# Altium schematic sheet Ideal Diode.SchDoc
size A4; Organization: TESLA Motors, INC; Address1: 3500 Deer Creek Road; Address2: Palo Alto, CA; Address4: U.S.A.; SheetNumber: 3; SheetTotal: 13
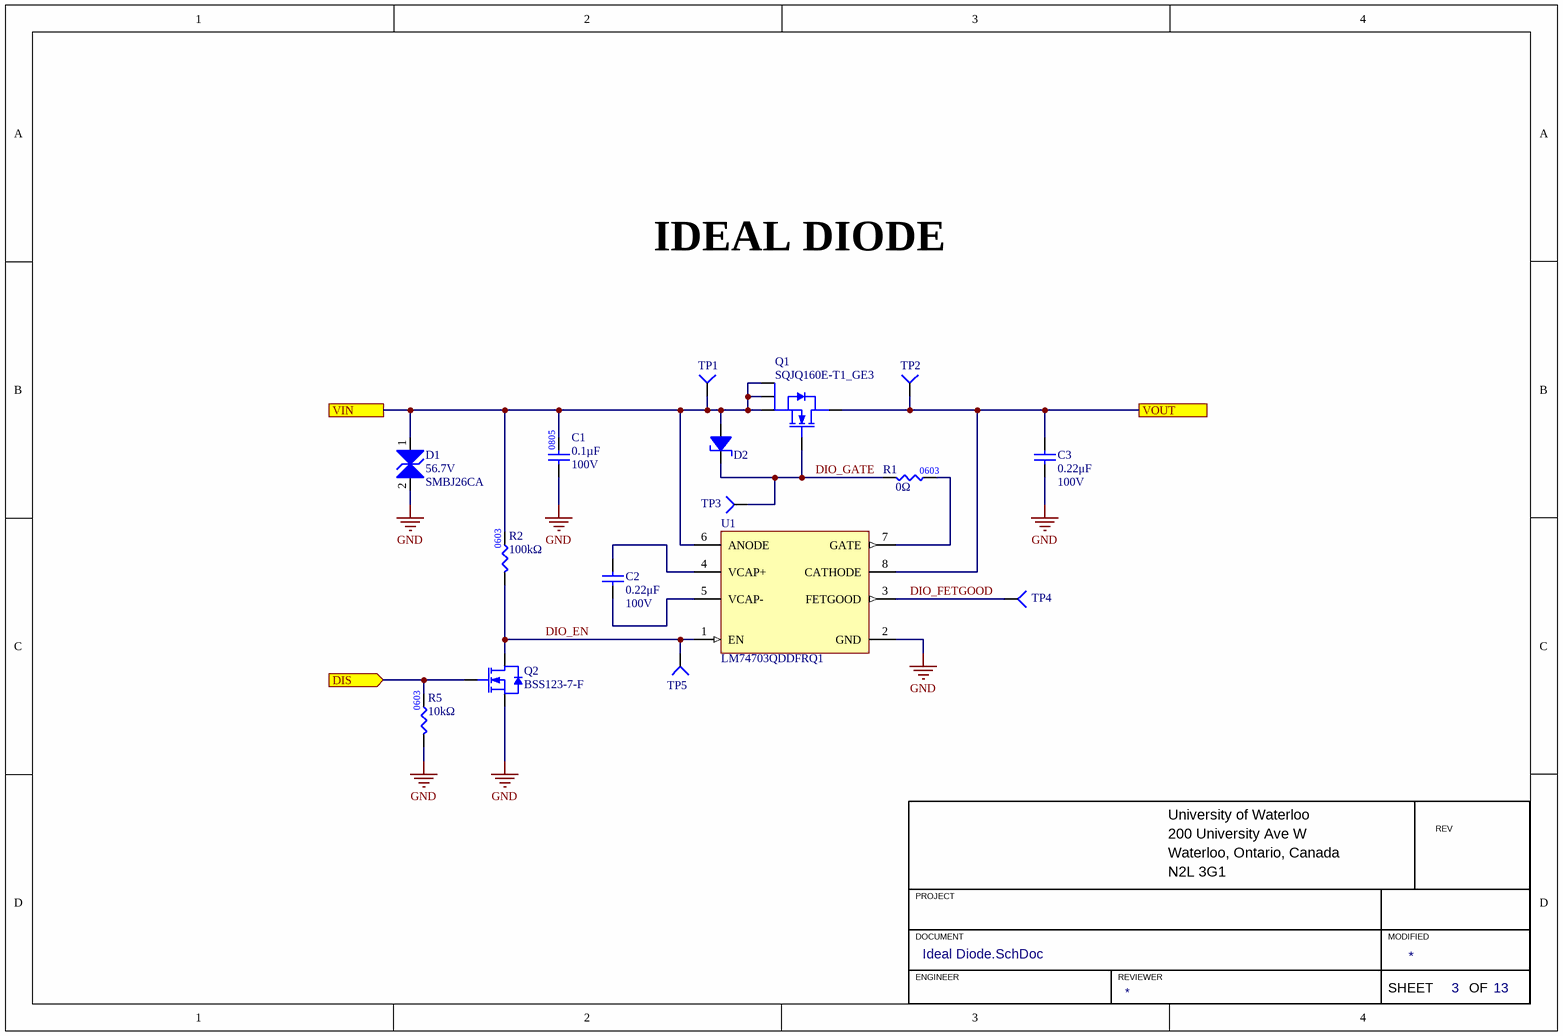
[diagram p0: Ideal Diode.SchDoc]

## Parts
C1  value 0.1µF  Voltage Rating: 100V  [CAP0805]  (hidden comment: CAP_0.1uF_100V_0805)
C2  value 0.22μF  Voltage Rating: 100V  [CAP0805]  (hidden comment: CAP_0.22uF_100V_0805)
C3  value 0.22μF  Voltage Rating: 100V  [CAP0805]  (hidden comment: CAP_0.22uF_100V_0805)
D1  Voltage - Breakdown (Min): 56.7V  Manufacturer Part Number 1: SMBJ26CA  [TVS_DIODE_BIDIR_SMB]  (hidden comment: TVS_DIODE_BIDIR_51V)
D2  DIO_ZENER_16V  [SOD-123_FLAT]  (value not drawn)
Q1  Manufacturer Part Number 1: SQJQ160E-T1_GE3  [VISHAY_PowerPAK-8x8]  (hidden comment: NMOS_60V_603A)
Q2  Manufacturer Part Number 1: BSS123-7-F  [SOT23-3]  (hidden comment: NMOS_100V_170mA)
R1  value 0Ω  [RES0603]  (hidden comment: RES_0Ω_0603)
R2  value 100kΩ  [RES0603]  (hidden comment: RES_100kΩ_0603_1%)
R5  value 10kΩ  [RES0603]  (hidden comment: RES_10kΩ_0603_1%)
TP1  TESTPOINT_1MM_SQUARE  [TESTPOINT_SQUARE_1MM]  (value not drawn)  (no BOM)
TP2  TESTPOINT_1MM_SQUARE  [TESTPOINT_SQUARE_1MM]  (value not drawn)  (no BOM)
TP3  TESTPOINT_1MM_CIRCLE  [TESTPOINT_CIRCLE_1MM]  (value not drawn)  (no BOM)
TP4  TESTPOINT_1MM_CIRCLE  [TESTPOINT_CIRCLE_1MM]  (value not drawn)  (no BOM)
TP5  TESTPOINT_1MM_CIRCLE  [TESTPOINT_CIRCLE_1MM]  (value not drawn)  (no BOM)
U1  LM74703QDDFRQ1  [TI_SOT23-8]

## Ports
DIS (in), VIN, VOUT

## Nets
GND: C1.1 C3.1 D1.2 Q2.2(SOURCE) R5.1 U1.2(GND)
DIO_EN: Q2.3(DRAIN) R2.1 TP5.1(=value) U1.1(EN)
DIO_FETGOOD: TP4.1(=value) U1.3(FETGOOD)
DIO_GATE: D2.2(Cathode) Q1.1(Gate) R1.1 TP3.1(=value)
DIS: Q2.1(GATE) R5.2 ; port DIS
VIN: C1.2 D1.1 D2.1(Anode) Q1.2(Source) Q1.3(Source) Q1.4(Source) R2.2 TP1.1(=value) U1.6(ANODE) ; port VIN
VOUT: C3.2 Q1.5(Drain) TP2.1(=value) U1.8(CATHODE) ; port VOUT
NetC2_1: C2.1 U1.5(VCAP-)
NetC2_2: C2.2 U1.4(VCAP+)
NetR1_2: R1.2 U1.7(GATE)

## Notes on the sheet
- IDEAL DIODE
- University of Waterloo
- 200 University Ave W
- REV
- PROJECT
- Waterloo, Ontario, Canada
- N2L 3G1
- DOCUMENT
- ENGINEER
- REVIEWER
- MODIFIED
- SHEET
- OF
- (in symbol RES_100kΩ_0603_1%) 0603

## Library data of the parts
C1 = CAP_0.1uF_100V_0805: CAP CER 0.1UF 100V X7R 0805; Manufacturer 1: TDK Corporation; Manufacturer Part Number 1: C2012X7R2A104K125AA; Package: 0805; Supplier 1: Digi-Key; Supplier Part Number 1: 445-1418-1-ND
C2 C3 = CAP_0.22uF_100V_0805: CAP CER 0.22UF 100V X7R 0805; Manufacturer Part Number 1: HMJ212BB7224KGHT; Manufacturer 1: Taiyo Yuden; Mounting Type: SMD; Package: 0805; Dielectric: X7R; Supplier 1: Digi-Key; Supplier Part Number 1: 587-4221-1-ND
D1 = TVS_DIODE_BIDIR_51V: TVS DIODE 51VWM 82.4VC DO214AA; Manufacturer 1: Littelfuse; Package/Footprint: SMB; Voltage - Clamping (Max) @ Ipp: 82.4V; Voltage - Reverse Standoff (Typ): 51V; Mounting Type: SMD; Supplier 1: Digi-Key; Supplier Part Number 1: SMBJ51CALFCT-ND
D2 = DIO_ZENER_16V: DIODE ZENER 16V 500MW SOD123; Manufacturer Part Number 1: DDZ9703-7; Manufacturer 1: Diodes Incorporated; Forward Voltage: 900mV; Supplier 1: Digi-Key; Supplier Part Number 1: DDZ9703-7DICT-ND
Q1 = NMOS_60V_603A: AUTOMOTIVE N-CHANNEL 60 V (D-S); Manufacturer 1: Vishay Siliconix; Vdss: 60V; Vgs (Max): 20V; Power Dissipation (Max): 600W; Id: 603A; Supplier 1: Digi-Key; Supplier Part Number 1: 742-SQJQ160E-T1_GE3CT-ND; FET Type: N-Channel; Supplier Device Package: PowerPak 8x8
Q2 = NMOS_100V_170mA: MOSFET N-CH 100V 170MA SOT23-3; Manufacturer 1: Diodes Incorporated; Supplier 1: Digi-Key; Supplier Part Number 1: BSS123-FDICT-ND
R1 = RES_0Ω_0603: RES 0 OHM JUMPER 1/10W 0603; Manufacturer 1: Yageo; Manufacturer Part Number 1: RC0603JR-070RL; Supplier Part Number 1: 311-0.0GRCT-ND; Supplier 1: Digi-Key; Mounting Type: SMD; Package: 0603
R2 = RES_100kΩ_0603_1%: RES 100K OHM 1% 1/10W 0603; Manufacturer 1: Yageo; Manufacturer Part Number 1: RC0603FR-07100KL; Supplier Part Number 1: 311-100KHRCT-ND; Supplier 1: Digi-Key
R5 = RES_10kΩ_0603_1%: RES 10K OHM 1% 1/8W 0603; Manufacturer 1: Stackpole Electronics Inc; Manufacturer Part Number 1: RNCP0603FTD10K0; Supplier Part Number 1: RNCP0603FTD10K0CT-ND; Supplier 1: Digi-Key; Mounting Type: SMD; Package: 0603
TP1 TP2 = TESTPOINT_1MM_SQUARE: TESTPOINT 1MM SQUARE
TP3-TP5 = TESTPOINT_1MM_CIRCLE: TESTPOINT 1MM CIRCLE
U1 = LM74703QDDFRQ1: AUTOMOTIVE IDEAL DIODE CONTROLLE; Manufacturer 1: Texas Instruments; Package/Footprint: SOT-23; Manufacturer Part Number 1: LM74703QDDFRQ1; Supplier 1: Digikey; Supplier Part Number 1: 296-LM74703QDDFRQ1CT-ND